# Altium schematic sheet 3V3_VoltageReg.SchDoc
size 420 x 297 mm; SheetNumber: 6; SheetTotal: 21
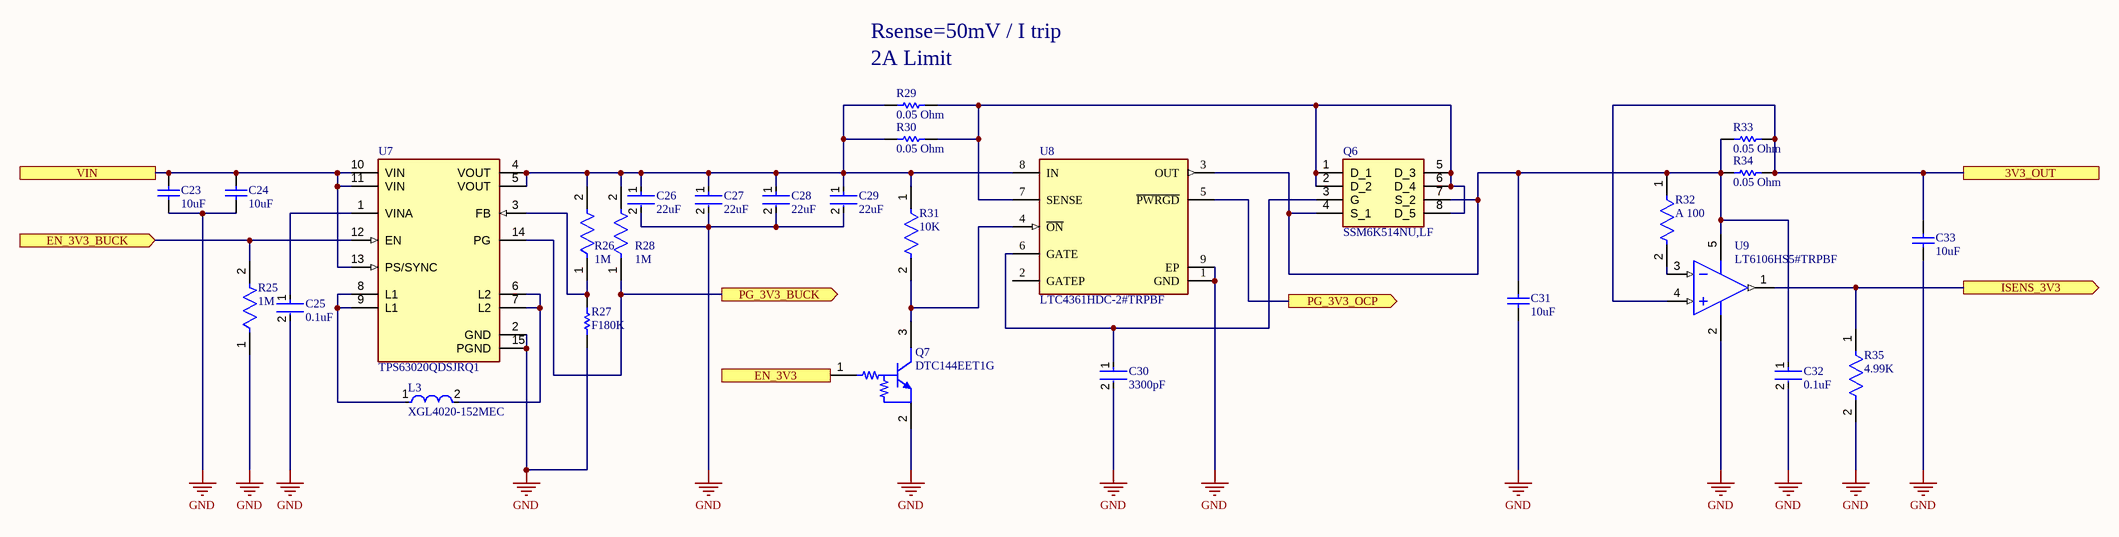
[diagram p0: 3V3_VoltageReg.SchDoc]

## Parts
C23  10uF  [CAPC2013X140X45NL15T25]
C24  10uF  [CAPC2013X140X45NL15T25]
C25  0.1uF  [FP-C0603C-CF-MFG]
C26  22uF  [FP-GRM21B-0_2-e0_2_0_7-IPC_C]
C27  22uF  [FP-GRM21B-0_2-e0_2_0_7-IPC_C]
C28  22uF  [FP-GRM21B-0_2-e0_2_0_7-IPC_C]
C29  22uF  [FP-GRM21B-0_2-e0_2_0_7-IPC_C]
C30  3300pF  [FP-C0603C-CF-MFG]
C31  10uF  [CAPC2013X140X45NL15T25]
C32  0.1uF  [FP-C0603C-CF-MFG]
C33  10uF  [CAPC2013X140X45NL15T25]
L3  XGL4020-152MEC  [FP-XGL4020-MFG]
Q6  SSM6K514NU,LF  [UDFN6B]
Q7  DTC144EET1G  [ONSC-SC-75-3-463-01_V]
R25  1M  [FP-ERJ3EK-IPC_C]
R26  1M  [FP-ERJ3EK-IPC_C]
R27  F180K  [RESC1608X55X30ML20T10]
R28  1M  [FP-ERJ3EK-IPC_C]
R29  0.05 Ohm  [RESC1608X55X30NL15T15]
R30  0.05 Ohm  [RESC1608X55X30NL15T15]
R31  10K  [FP-RK73B1J-MFG]
R32  A 100  [FP-ERA3A-IPC_B]
R33  0.05 Ohm  [RESC1608X55X30NL15T15]
R34  0.05 Ohm  [RESC1608X55X30NL15T15]
R35  4.99K  [FP-ERA3A-IPC_C]
U7  TPS63020QDSJRQ1  [FP-DSJ0014A-MFG]
U8  LTC4361HDC-2#TRPBF  [FP-DC8-8-05-08-1719-IPC_C]
U9  LT6106HS5#TRPBF  [LT-S5-5-TSOT-23_M]

## Ports
3V3_OUT, EN_3V3 (in), EN_3V3_BUCK (in), ISENS_3V3 (out), PG_3V3_BUCK (out), PG_3V3_OCP (out), VIN

## Nets
GND: C23.1 C24.1 C25.2 C26.2 C27.2 C28.2 C29.2 C30.2 C31.1 C32.2 C33.1 Q7.2(E) R25.1 R27.1 R35.2 U7.2(GND) U7.15(PGND) U8.1(GND) U8.9(EP) U9.2(V-)
3V3_OUT: C33.2 R33.2 R34.2 U9.4(+IN) ; port 3V3_OUT
EN_3V3: Q7.1(B) ; port EN_3V3
EN_3V3_BUCK: R25.2 U7.12(EN) ; port EN_3V3_BUCK
ISENS_3V3: R35.1 U9.1(OUT) ; port ISENS_3V3
PG_3V3_BUCK: R28.1 U7.14(PG) ; port PG_3V3_BUCK
PG_3V3_OCP: U8.5(~{PWRGD}) ; port PG_3V3_OCP
VIN: C23.2 C24.2 U7.10(VIN) U7.11(VIN) U7.13(PS/SYNC) ; port VIN
NetC25_1: C25.1 U7.1(VINA)
NetC26_1: C26.1 C27.1 C28.1 C29.1 R26.2 R28.2 R29.1 R30.1 R31.1 U7.4(VOUT) U7.5(VOUT) U8.8(IN)
NetC30_1: C30.1 Q6.3(G) U8.6(GATE)
NetC31_2: C31.2 C32.1 Q6.4(S_1) Q6.7(S_2) R32.1 R33.1 R34.1 U8.3(OUT) U9.5(V+)
NetL3_1: L3.1 U7.8(L1) U7.9(L1)
NetL3_2: L3.2 U7.6(L2) U7.7(L2)
NetQ6_1: Q6.1(D_1) Q6.2(D_2) Q6.5(D_3) Q6.6(D_4) Q6.8(D_5) R29.2 R30.2 U8.7(SENSE)
NetQ7_3: Q7.3(C) R31.2 U8.4(~{ON})
NetR26_1: R26.1 R27.2 U7.3(FB)
NetR32_2: R32.2 U9.3(-IN)

Not connected (* = marked no-connect by the designer): U8 2(GATEP)

## Notes on the sheet
- Rsense=50mV / I trip
- (near R29) 2A Limit
- THIS DOCUMENT AND THE DATA DISCLOSED HEREIN OR
- HEREWITH IS THE PROPERTY OF ALTIUM LIMITED AND MAY
- DWG NO:
- REVISION
- REV:
- DESCRIPTION
- DATE
- APPROVED
- BE FREELY DISTRIBUTED IN WHOLE. NO RIGHTS ARE
- RESERVED OR EXPRESS OR IMPLIED WARANTEE GIVEN.
- ENG:
- APPROVALS
- PROJECT
- DSN:
- CHK:
- REFERENCE DOCUMENTS
- PROJECT REVISION:
- TITLE
- DOCUMENT REVISION:
- DESIGN ITEM:
- BOM:
- FAB DWG:
- PCB DWG:
- ASSY DWG:
- SCALE:
- A3
- SIZE
- CAGE CODE
- FILE NAME
- DWG NO.
- SHEET
- OF
- REV

## Library data of the parts
C23 C24 C31 C33 = CMP-2007-03395-1: Part Number: GRM21BR71A106KE51L; Manufacturer: Murata
C25 C32 = CMP-2006-03061-2: CAP CER 0.1UF 50V X7R 0603; Manufacturer: KEMET; Manufacturer Part Number: C0603C104K5RACTU; Tolerance: 0.1; Temperature Coefficient: 30ppm/°C; Material: Ceramic; Automotive Grade: Grade 1; Value: 0.10 μF; Temperature: -55°C to +125°C; RoHS: TRUE; Temperature Range High: +125°C; Lead Free: Yes; Octopart: https://octopart.com/c0603c104k5ractu-kemet-139244; Digikey Description: CAP CER 0.1UF 50V X7R 0603; Category: Cap; Package: C0603C-CF; ComponentLink2Description: Datasheet; Temperature Range Low: -55°C; Device Class L1: Passive Components; Voltage Rating: 50 V; Automotive: Yes; Device Class L3: Ceramic Capacitors; ComponentLink2URL: https://api.kemet.com/component-edge/download/datasheet/C0603C100J5GACAUTO.pdf; Capacitance: 0.10 μF; Device Class L2: Capacitors; Temperature Characteristic: X7R; Height: 0.87mm
C26-C29 = CMP-06035-025845-1: Chip Multilayer Ceramic Capacitors for General Purpose, 0805, 22uF, X7T, +22%/-33%, 20%, 10V; Dissipation Factor: 0.035%; Height: 1.25mm; Min Operating Temperature: -55°C; Case/Package: 0805; Packaging: Tape and Reel; Voltage: 10V; Depth: 1.25mm; Width: 1.25mm; Voltage Rating: 10V; Dielectric: X7T; Weight: 0.000335oz; Capacitance: 22uF; Mount: Surface Mount; Package Quantity: 3000; Lead Free: Lead Free; Tolerance: 20%; Thickness: 0.057inch; Max Operating Temperature: 125°C; Length: 2mm; Material: Ceramic; Case Code (Metric): 2012; Termination: SMD/SMT; Voltage Rating (DC): 10V; Dielectric Material: Ceramic; Case Code (Imperial): 0805
C30 = CMP-2006-03174-2: CAP CER 3300PF 50V 5% X7R 0603; Manufacturer Part Number: C0603C332J5RACTU; Manufacturer: KEMET; Automotive Grade: Grade 1; Material: Ceramic; Value: 3,300 pF; Temperature Coefficient: 30ppm/°C; Tolerance: 0.05; Temperature Range Low: -55°C; Device Class L3: Ceramic Capacitors; Temperature Characteristic: X7R; Temperature: -55°C to +125°C; Device Class L1: Passive Components; ComponentLink2URL: https://api.kemet.com/component-edge/download/datasheet/C0603C100J5GACAUTO.pdf; Automotive: Yes; Capacitance: 3,300 pF; RoHS: TRUE; Mouser Description: Multilayer Ceramic Capacitors MLCC - SMD/SMT 50volts 3300pF X7R 5%; Height: 0.87mm; Temperature Range High: +125°C; ComponentLink2Description: Datasheet; Voltage Rating: 50 V; Octopart: https://octopart.com/c0603c332j5ractu-kemet-9139905; Package: C0603C-CF; Lead Free: Yes; Device Class L2: Capacitors; Digikey Description: CAP CER 3300PF 50V 5% X7R 0603; Category: Cap
L3 = CMP-11268-000020-1: Shielded Power Inductors; Manufacturer: Coilcraft; Saturation Current: 3.2A; Rms Current: 11.1A; Standoff Height: 0.12mm; Inductance: 1.5uH; Self Resonant Frequency: 45MHz; Series Resistance: 14.3mΩ; Test Frequency: 1MHz; Value: 1.5uH; Automotive Grade: Grade 1; Tolerance: 20%; Shielding: true; Core Material: Wirewound; ComponentLink2Description: Datasheet; Device Class L3: Fixed Inductors; Category: Ind; Device Class L2: Inductors; Package: XGL4020; Automotive: Yes; Ambient Temperature Range Low: -40°C; Manufacturer Part Number: XGL4020-152MEC; ComponentLink2URL: https://www.coilcraft.com/pdfs/xgl4020.pdf; Lead Free: Yes; RoHS: TRUE; Height: 2.1mm; Device Class L1: Passive Components; Composition: Composite; Ambient Temperature Range High: +125°C; Octopart: https://octopart.com/xgl4020-152mec-coilcraft-99681026
Q6 = SSM6K514NU,LF: MOSFET (N-Channel); Manufacturer_Name: Toshiba; Datasheet Link: http://toshiba.semicon-storage.com/info/docget.jsp?did=29875&prodName=SSM6N7002CFU; Manufacturer_Part_Number: SSM6K514NU,LF; Mouser Part Number: 757-SSM6K514NULF; Mouser Price/Stock: https://www.mouser.co.uk/ProductDetail/Toshiba/SSM6K514NULF?qs=yfGysFjEcj13lHFOvblArQ%3D%3D; Arrow Part Number: SSM6K514NU,LF; Arrow Price/Stock: https://www.arrow.com/en/products/ssm6k514nulf/toshiba?region=nac
Q7 = CMP-0630-00198-1: Digital Transistor (BRT), R1=47 kOhm, R2=47 kOhm, NPN Transistor, 3-Pin SC-75, Pb-Free, Tape and Reel; Manufacturer: On Semiconductor; hFE Min: 80; R1/R2 Typ: 1; IC Continuous (A): 0.1; V(BR)CEO Min (V): 50; Mounting Technology: Surface Mount; PartNumber: DTC144EET1G; Polarity: NPN; PackageReference: SC-75-3-463-01; ComponentLink2URL: http://www.onsemi.cn/pub_link/Collateral/DTC144E-D.PDF; PackageVersion: Rev. F, 07/2005; ComponentLink3Description: Package Specification; ComponentLink1Description: Manufacturer URL; ComponentLink1URL: http://www.onsemi.com/; DatasheetVersion: Rev. 2; Packing: Tape and Reel; PackageDescription: 3-Pin Small Outline Transistor, Body 1.6 x 0.8 mm, Pitch 0.5 mm; ComponentLink2Description: Datasheet; RoHS: TRUE; ComponentLink3URL: http://www.onsemi.com/pub_link/Collateral/463-01.PDF
R25 R26 R28 = CMP-1012-00849-3: RES SMD 1M OHM 1% 1/10W 0603; Resistance: 1MR; Voltage Rating: 75V; Temperature Coefficient: 100ppm/°C; Power Rating: 100mW; REACH SVHC: No SVHC; Radiation Hardening: No; Features: Automotive AEC-Q200; Case Code (Metric): 1608; Resistance Tolerance: 1%; Case/Package: 0603; Termination: SMD/SMT; Max Operating Temperature: 155°C; Tolerance: 1%; Size Code: 0603; Case Code (Imperial): 0603; Min Operating Temperature: -55°C; Number of Pins: 2; Mount: Surface Mount; Package Quantity: 1; Military Standard: Not; Voltage Rating (DC): 75V; Depth: 0.8mm; Packaging: Tape and Reel; Width: 0.8mm; Number of Terminations: 2; Length: 1.6mm; Height: 0.022inch; RoHS Compliant: Yes; Resistor Type: Thick Film; Contact Plating: Tin; Lead Free: Lead Free; Series: ERJ; Construction: Rectangular; Max Power Dissipation: 100mW
R27 = CMP-2000-01245-1: Manufacturer: KOA Speer; Part Number: RK73H1JTTD1803F
R29 R30 R33 R34 = CMP-2000-00867-1: Manufacturer: Panasonic; Part Number: ERJ-L03KF50MV
R31 = CMP-2000-01851-2: RES 10K OHM 5% 1/10W 0603; Temperature Coefficient: 200ppm/°C; Voltage Rating: 50V; Power Rating: 100mW; Resistance: 10kR; Length: 1.6mm; Lead Free: Lead Free; Resistance Tolerance: 5%; Case Code (Metric): 1608; Width: 0.8mm; Height: 0.45mm; Max Operating Temperature: 155°C; RoHS Compliant: Yes; Resistor Type: Thick Film; Min Operating Temperature: -55°C; Case Code (Imperial): 0603; Technology: THICK FILM; Package Quantity: 5000; Tolerance: 5%; Case/Package: 0603; Voltage Rating (DC): 50V; Depth: 0.8mm; Packaging: Tape and Reel; Number of Pins: 2; Construction: Rectangular; Series: RK73B; Military Standard: Not; Termination: SMD/SMT
R32 = CMP-2000-00870-2: RES SMD 100 OHM 0.1% 1/10W 0603; Voltage Rating: 75V; Power Rating: 100mW; Resistance: 100R; Temperature Coefficient: 25ppm/°C; Number of Terminations: 2; Case/Package: 0603; Termination: SMD/SMT; Number of Pins: 2; Size Code: 0603; Length: 1.6mm; Min Operating Temperature: -55°C; Resistor Type: Thin Film; Depth: 0.8mm; Military Standard: Not; Packaging: Tape and Reel; RoHS Compliant: Yes; Construction: Rectangular; Resistance Tolerance: 0.1%; Contact Plating: Tin; Width: 0.8mm; Mount: Surface Mount; Case Code (Metric): 1608; Max Operating Temperature: 155°C; Height: 0.45mm; Case Code (Imperial): 0603; Series: ERA-3A; Package Quantity: 5000; REACH SVHC: No SVHC; Tolerance: 0.1%; Max Power Dissipation: 100mW; Radiation Hardening: No; Technology: METAL FILM
R35 = CMP-2000-00077-5: RES SMD 4.99KOHM 0.1% 1/10W 0603; Voltage Rating (DC): 75V; Max Power Dissipation: 100mW; Temperature Coefficient: 25ppm/°C; Resistance: 4.99kR; Voltage Rating: 150V; Features: Automotive AEC-Q200; Depth: 0.8mm; Case Code (Imperial): 0603; Resistance Tolerance: 0.1%; Mount: Surface Mount; Contact Plating: Tin; Length: 1.6mm; RoHS Compliant: Yes; Termination: SMD/SMT; Width: 0.8mm; Case/Package: 0603; Series: ERA; Radiation Hardening: No; Tolerance: 0.1%; Lead Free: Lead Free; Technology: METAL FILM; Construction: Rectangular; Number of Terminations: 2; Weight: 7.1E-05oz; Power Rating: 100mW; Number of Pins: 2; Min Operating Temperature: -55°C; Height: 0.45mm; Case Code (Metric): 1608; Package Quantity: 5000; Military Standard: Not; Max Operating Temperature: 155°C; Resistor Type: Thin Film; Reach SVHC Compliant: Yes; Packaging: Tape and Reel
U7 = CMP-04918-000114-1: IC REG BCK BST ADJ 3.5A 14VSON; Manufacturer: Texas Instruments; Max Supply Voltage: 5.5V; Number Of Outputs: 1; Output Current: 2A; Max Duty Cycle: 100%; Nominal Supply Current: 5-25uA; Standoff Height: 0mm; Output Voltage: 1.2-5.5V; Min Supply Voltage: 1.8V; Output Type: AdjustableProgrammable; Automotive Grade: Grade 1; Max Junction Temp: +125°C; Switching Frequency: 2400kHz; Switching Topology: Buck-Boost; Category: IC; RoHS: TRUE; Device Class L2: Power Management ICs; Device Class L3: Voltage Regulators - Switching; Automotive: Yes; Mouser Description: Switching Voltage Regulators Single Inductor Buck Boost Converter; ComponentLink2URL: http://www.ti.com/lit/ds/symlink/tps63020-q1.pdf; Octopart: https://octopart.com/tps63020qdsjrq1-texas+instruments-66805608; Temperature: -40°C to +125°C; Package: DSJ0014A; Temperature Range Low: -40°C; Temperature Range High: +125°C; Digikey Description: IC REG BCK BST ADJ 3.5A 14VSON; Device Class L1: Integrated Circuits (ICs); Manufacturer Part Number: TPS63020QDSJRQ1; Height: 1mm; Lead Free: Yes; ComponentLink2Description: Datasheet
U8 = CMP-0474-00015-2: IC OVP/OCP PROTECTION CTLR 8DFN; Number of Circuits: 1; RoHS Compliant: Yes; Packaging: Tape and Reel; Case/Package: DFN; Number of Pins: 8; Package Quantity: 2500
U9 = CMP-0359-01984-2: Single Channel, Low Cost, High Side Current Sense Operational Amplifier, 0.2 MHz Typical GBW, 5-Pin SOT-23 (S5-5), High Temperature / Automotive, Pb-Free, Reel; Manufacturer: Linear Technology; Linear Technology Part Number: LT6106; Vos (mV) Typical: 0.15; Vs Min (V): 2.7; Vs Max (V): 36; Is (mA) Typical: 0.06; Vos (mV) Guaranteed: 0.25; Channels (#): 1; GBW (MHz) Typical: 0.2; PackageDescription: 5-Lead Plastic TSOT-23, Body 1.63 x 2.90 mm, Pitch 0.95 mm; ComponentLink3Description: Package Specification; Mounting Technology: Surface Mount; Type: CSA; RevisionNote: URLs updated; ComponentLink2URL: http://cds.linear.com/docs/en/datasheet/6106fa.pdf; ComponentLink1URL: http://www.linear.com/; Code_JEDEC: MO-193; PartNumber: LT6106HS5#TRPBF; Packing: Reel; DatasheetVersion: Rev. A; RoHS: Pb-Free; ComponentLink3URL: http://cds.linear.com/docs/en/packaging/SOT_5_05-08-1635.pdf; ComponentLink1Description: Manufacturer URL; PackageReference: LT-S5-5-TSOT-23; ComponentLink2Description: Datasheet